# EAGLE schematic I2C_Servo v2 (EAGLE 7.2.0)
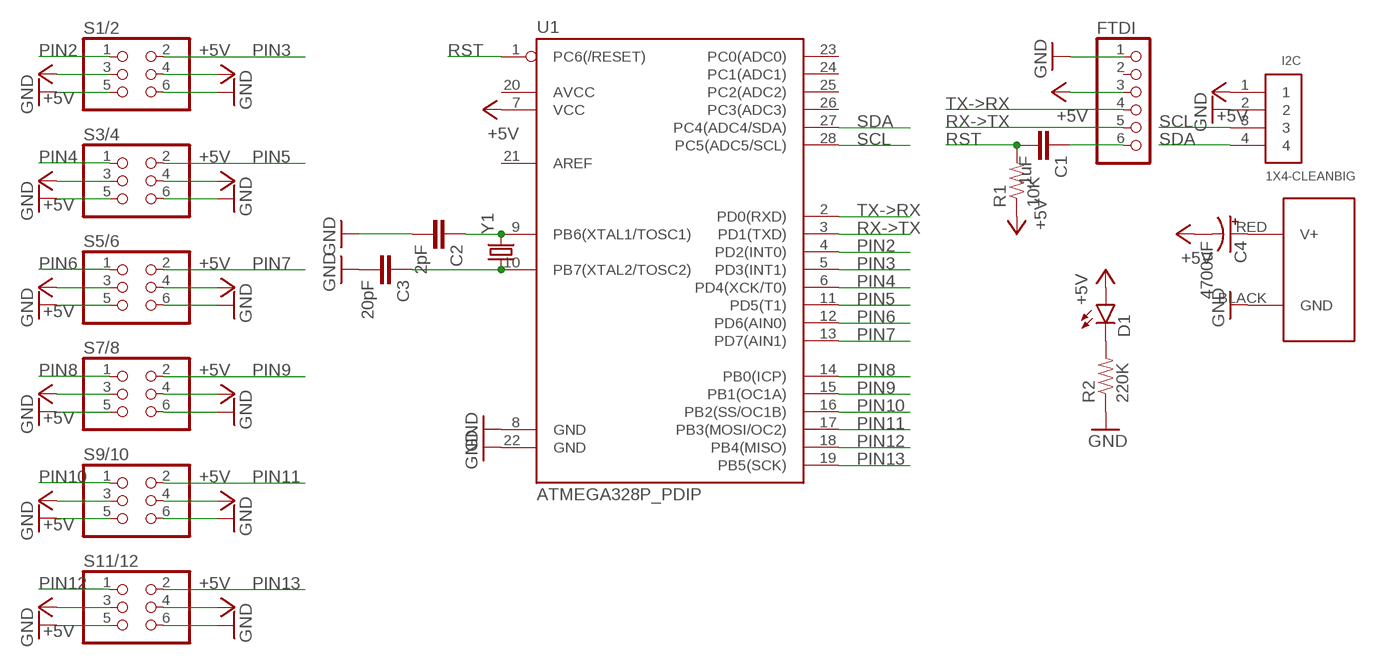
[diagram p0: schematic, sheet 1]

## Parts
C1  .1uF  CAPPTH  [CAP-PTH-SMALL]
C2  2pF  CAPPTH  [CAP-PTH-SMALL]
C3  20pF  CAPPTH  [CAP-PTH-SMALL]
C4  4700uF  CPOL-USE5-13  [E5-13]
D1  LED3MM  [LED3MM]
FTDI  PINHD-1X6CLEAN  [1X06-CLEAN]
I2C  1X4-CLEANBIG  [1X04-CLEANBIG]
J1  POWERPOLE_POWER25A_HORIZONTAL_G2  [POWERPOLE_PAIR_25A_HORIZ_G2]
R1  10K  RESISTORAXIAL-0.3  [AXIAL-0.3]
R2  220K  RESISTORAXIAL-0.3  [AXIAL-0.3]
S1/2  PINHD-2X3  [2X03]
S3/4  PINHD-2X3  [2X03]
S5/6  PINHD-2X3  [2X03]
S7/8  PINHD-2X3  [2X03]
S9/10  PINHD-2X3  [2X03]
S11/12  PINHD-2X3  [2X03]
U1  ATMEGA328P_PDIP  [DIL28-3]
Y1  CRYSTALHC49US  [HC49US]

## Nets
+5V: C4.- D1.A FTDI.3 I2C.1 R1.P$1 S1/2.3 S1/2.4 S3/4.3 S3/4.4 S5/6.3 S5/6.4 S7/8.3 S7/8.4 S9/10.3 S9/10.4 S11/12.3 S11/12.4 U1.7(VCC)
GND: C2.2 C3.2 FTDI.1 I2C.2 J1.BLACK(GND) R2.P$1 S1/2.5 S1/2.6 S3/4.5 S3/4.6 S5/6.5 S5/6.6 S7/8.5 S7/8.6 S9/10.5 S9/10.6 S11/12.5 S11/12.6 U1.8(GND) U1.22(GND)
N$1: C1.1 FTDI.6
N$2: C2.1 U1.9(PB6(XTAL1/TOSC1)) Y1.2
N$3: C3.1 U1.10(PB7(XTAL2/TOSC2)) Y1.1
N$4: C4.+ J1.RED(V+)
N$5: D1.K(C) R2.P$2
PIN2: S1/2.1 U1.4(PD2(INT0))
PIN3: S1/2.2 U1.5(PD3(INT1))
PIN4: S3/4.1 U1.6(PD4(XCK/T0))
PIN5: S3/4.2 U1.11(PD5(T1))
PIN6: S5/6.1 U1.12(PD6(AIN0))
PIN7: S5/6.2 U1.13(PD7(AIN1))
PIN8: S7/8.1 U1.14(PB0(ICP))
PIN9: S7/8.2 U1.15(PB1(OC1A))
PIN10: S9/10.1 U1.16(PB2(SS/OC1B))
PIN11: S9/10.2 U1.17(PB3(MOSI/OC2))
PIN12: S11/12.1 U1.18(PB4(MISO))
PIN13: S11/12.2 U1.19(PB5(SCK))
RST: C1.2 R1.P$2 U1.1(PC6(/RESET))
RX->TX: FTDI.5 U1.3(PD1(TXD))
SCL: I2C.3 U1.28(PC5(ADC5/SCL))
SDA: I2C.4 U1.27(PC4(ADC4/SDA))
TX->RX: FTDI.4 U1.2(PD0(RXD))
Unconnected: FTDI.2 U1.20(AVCC) U1.21(AREF) U1.23(PC0(ADC0)) U1.24(PC1(ADC1)) U1.25(PC2(ADC2)) U1.26(PC3(ADC3))

## Library data of the parts
C1-C3 = SparkFun-Passives:CAP: Capacitor Standard 0603 ceramic capacitor, and 0.1" leaded capacitor.
C4 = adafruit:CPOL-US: POLARIZED CAPACITOR, American symbol
D1 = SparkFun-LED:LED: LEDs Standard schematic elements and footprints for 5mm, 3mm, 1206, and 0603 sized LEDs. 5mm - Spark Fun Electronics SKU : COM-00529 (and others)
FTDI = adafruit:PINHD-1X6: PIN HEADER
I2C = adafruit:1X4: 4-pin connector
J1 = powerpoles:POWERPOLE_POWER: Anderson Powerpole Power Connector using ameteur radio standard layout
R1 R2 = SparkFun-Passives:RESISTOR: Resistor Basic schematic elements and footprints for 0603, 1206, and PTH resistors.
S1/2 S3/4 S5/6 S7/8 S9/10 S11/12 = SparkFun-Connectors:PINHD-2X3: PIN HEADER
U1 = SparkFun-DigitalIC:ATMEGA328P_PDIP: uC used in the Arduino 32kb flash, 1k EEPROM, 2k SRAM This is the through-hole version of this chip.
Y1 = SparkFun-FreqCtrl:CRYSTAL: Various standard crystals. Proven footprints.